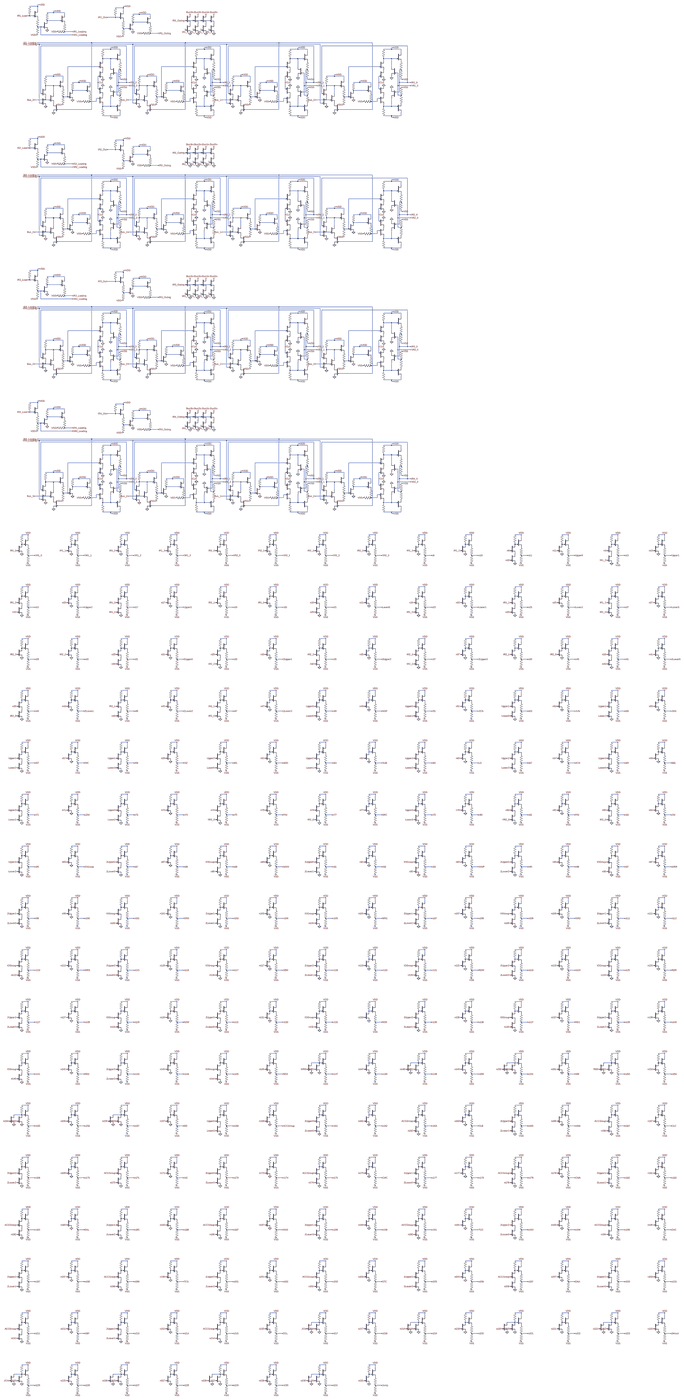
[diagram p0: schematic instruction_register_16bit.asc, whole sheet]
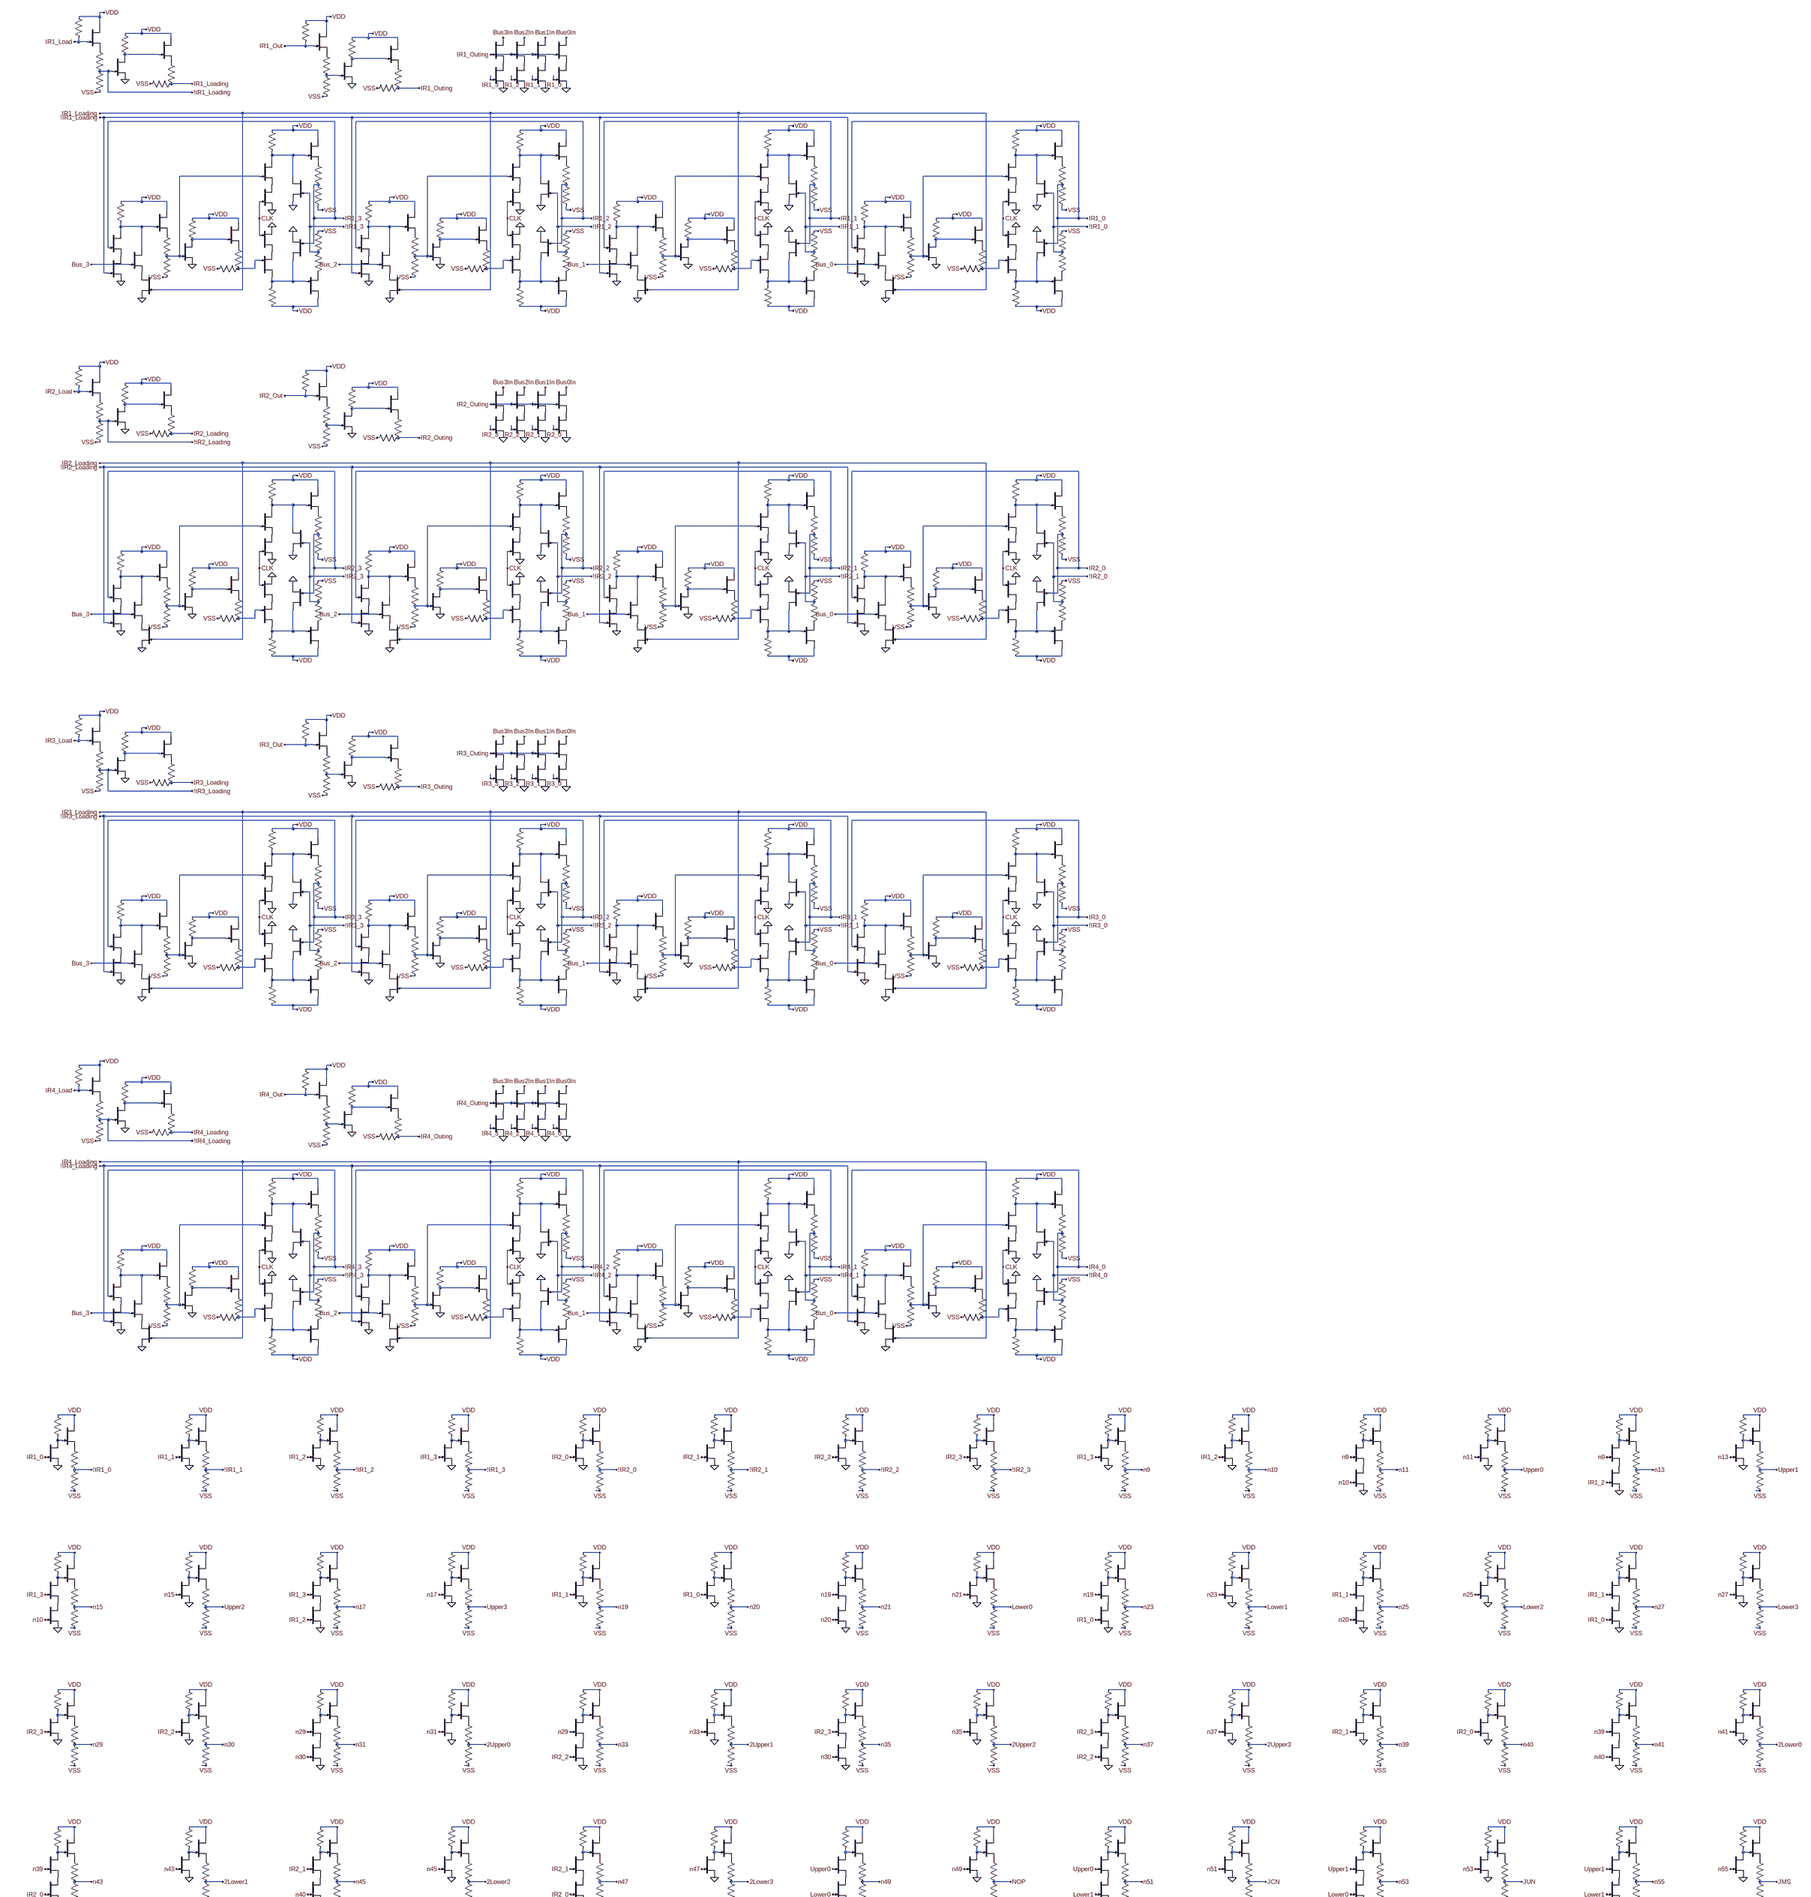
[diagram p1: schematic instruction_register_16bit.asc, part, row 1 of 2, column 1 of 1]
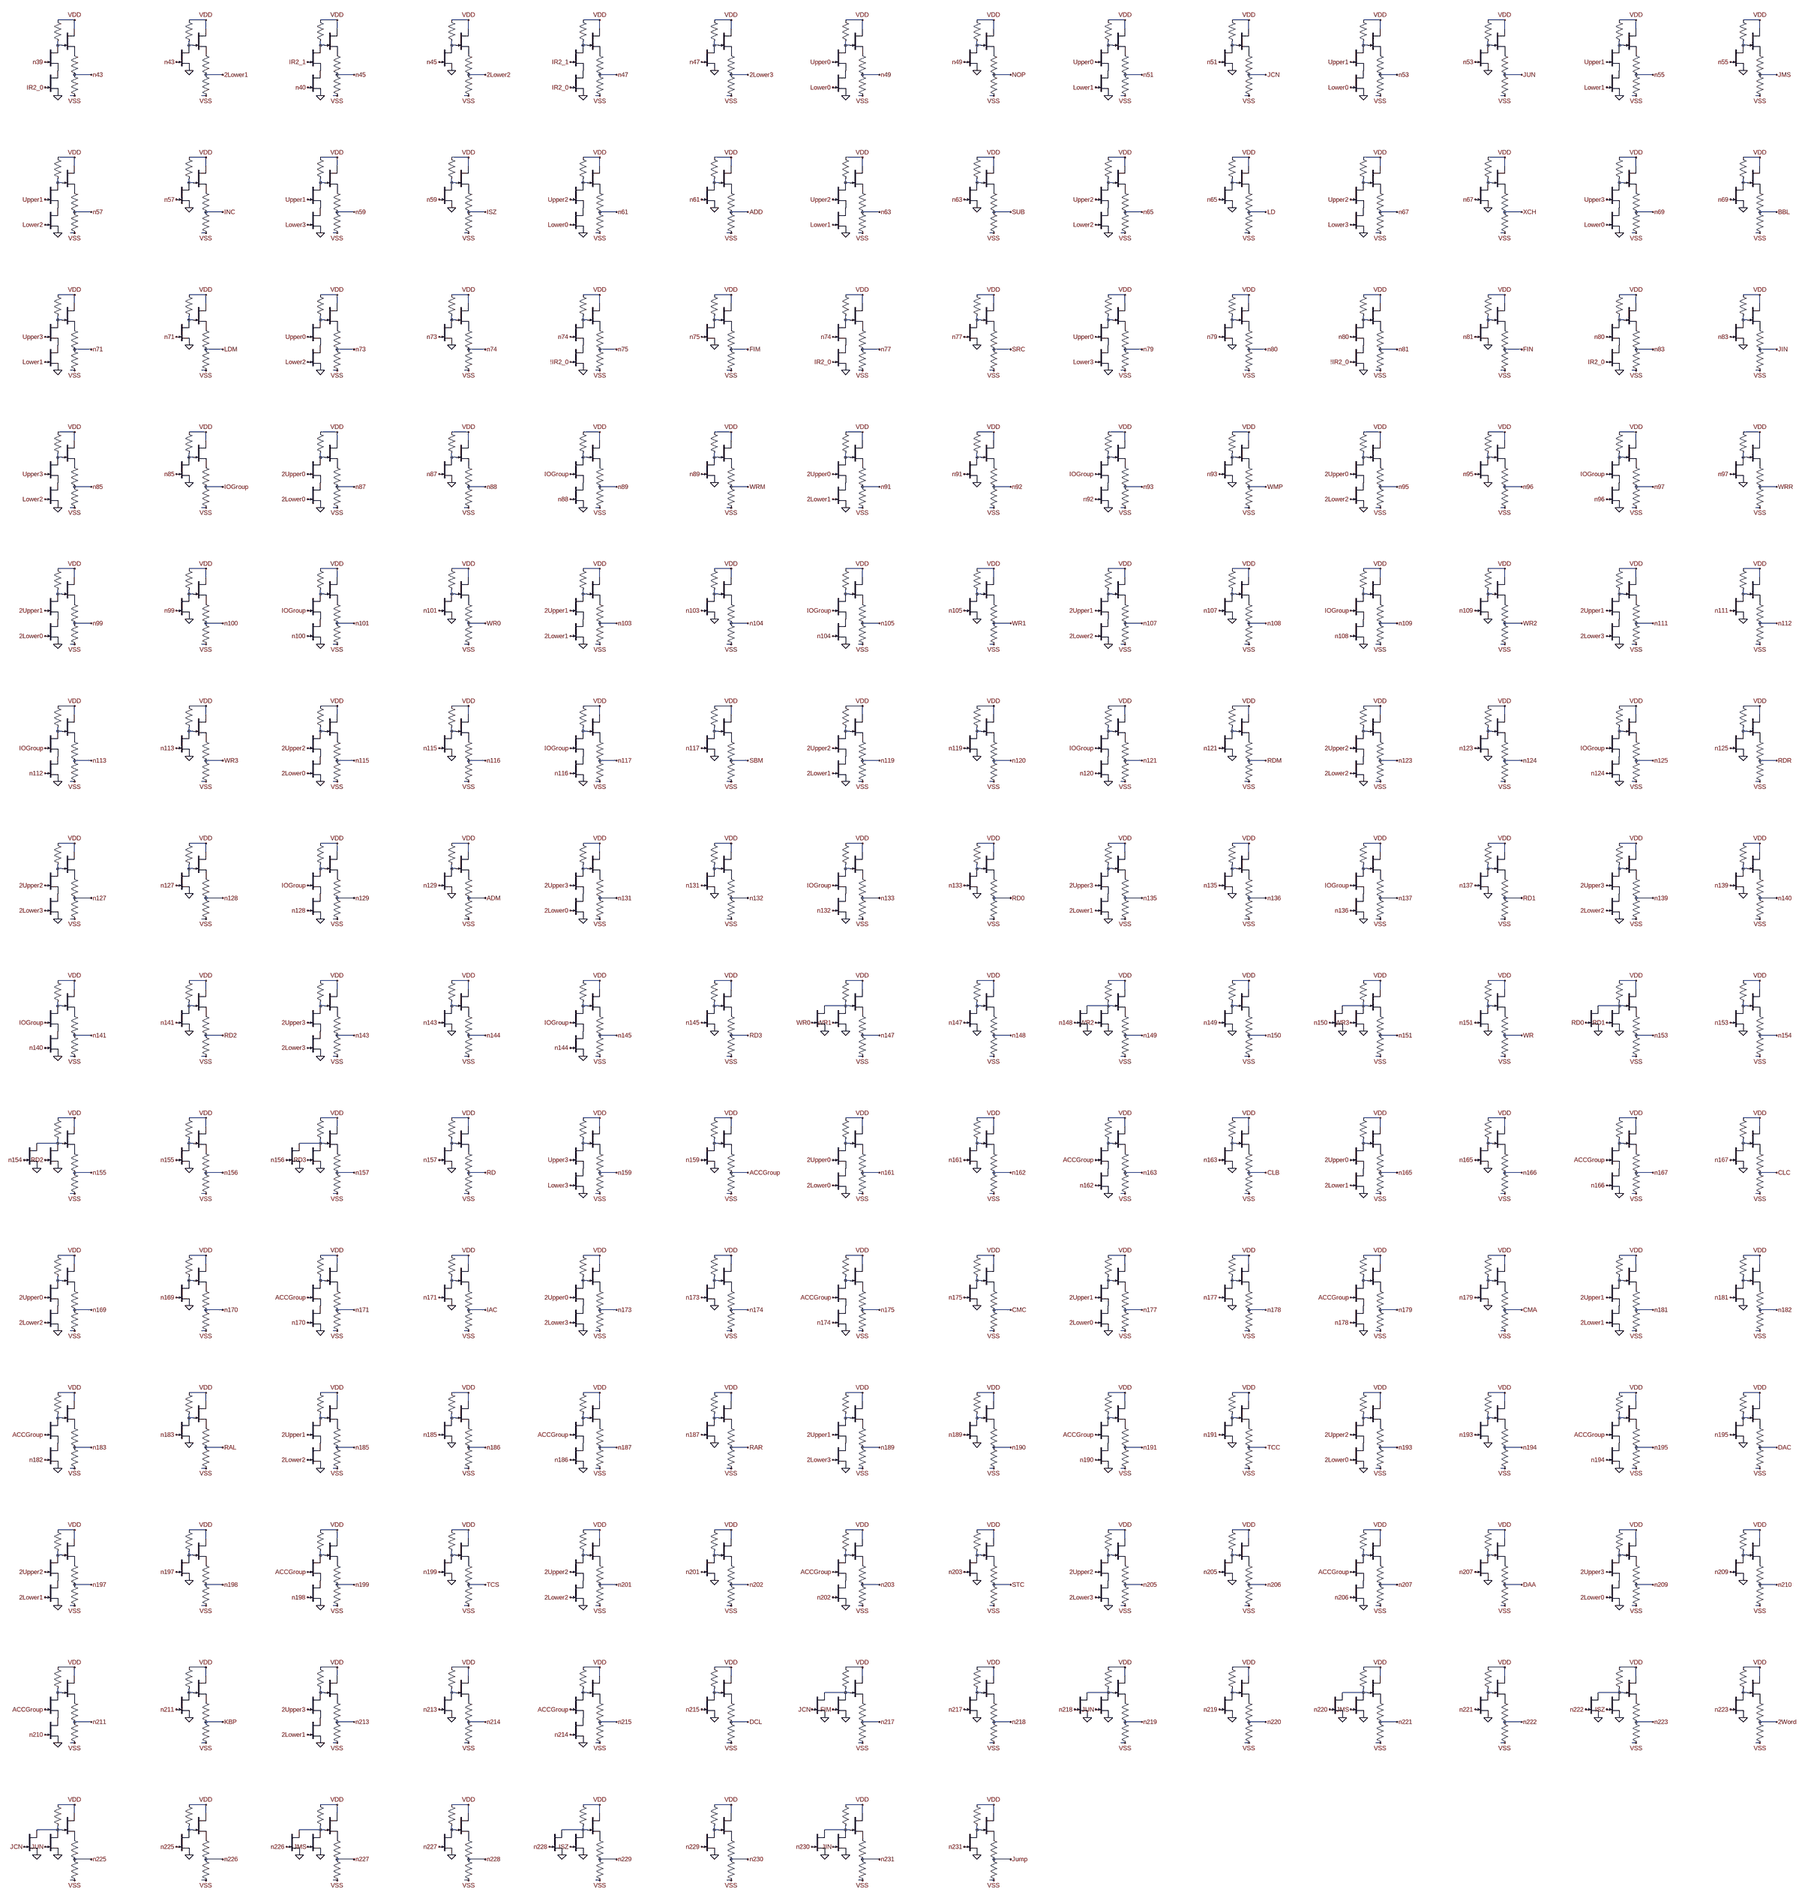
[diagram p2: schematic instruction_register_16bit.asc, part, row 2 of 2, column 1 of 1]
* instruction_register_16bit.asc
R1 VDD IR1_Load 100k
J_F1 VDD IR1_Load P001 DR
R2 P001 !IR1_Loading 1k
R3 !IR1_Loading VSS 4.8k
J_A1 N001 !IR1_Loading 0 DR
R4 VDD N001 50k
J_A2 VDD N001 P002 DR
R5 P002 IR1_Loading 1k
R6 IR1_Loading VSS 4.5k
R7 VDD IR1_Out 100k
J_F2 VDD IR1_Out P003 DR
R8 P003 N003 1k
R9 N003 VSS 4.8k
J_A3 N002 N003 0 DR
R10 VDD N002 50k
J_A4 VDD N002 P004 DR
R11 P004 IR1_Outing 1k
R12 IR1_Outing VSS 4.5k
J_A5 N004 N005 P005 DR
R13 VDD N004 100k
J_F3 VDD N004 P006 DR
R14 P006 IR1_3 1k
R15 IR1_3 VSS 4.8k
J_B1 N004 !IR1_3 0 DR
J_A6 N009 N008 P007 DR
R16 VDD N009 100k
J_F4 VDD N009 P008 DR
R17 P008 !IR1_3 1k
R18 !IR1_3 VSS 4.8k
J_B2 N009 IR1_3 0 DR
J_A7 P005 CLK 0 DR
J_A8 P007 CLK 0 DR
J_A9 N006 IR1_3 P009 DR
R19 VDD N006 100k
J_F5 VDD N006 P010 DR
R20 P010 N005 1k
R21 N005 VSS 4.8k
J_B3 N006 Bus_3 P011 DR
J_A10 N007 N005 0 DR
R22 VDD N007 50k
J_A11 VDD N007 P012 DR
R23 P012 N008 1k
R24 N008 VSS 4.5k
J_A12 P009 !IR1_Loading 0 DR
J_B4 P011 IR1_Loading 0 DR
J_A13 N010 N011 P013 DR
R25 VDD N010 100k
J_F6 VDD N010 P014 DR
R26 P014 IR1_2 1k
R27 IR1_2 VSS 4.8k
J_B5 N010 !IR1_2 0 DR
J_A14 N015 N014 P015 DR
R28 VDD N015 100k
J_F7 VDD N015 P016 DR
R29 P016 !IR1_2 1k
R30 !IR1_2 VSS 4.8k
J_B6 N015 IR1_2 0 DR
J_A15 P013 CLK 0 DR
J_A16 P015 CLK 0 DR
J_A17 N012 IR1_2 P017 DR
R31 VDD N012 100k
J_F8 VDD N012 P018 DR
R32 P018 N011 1k
R33 N011 VSS 4.8k
J_B7 N012 Bus_2 P019 DR
J_A18 N013 N011 0 DR
R34 VDD N013 50k
J_A19 VDD N013 P020 DR
R35 P020 N014 1k
R36 N014 VSS 4.5k
J_A20 P017 !IR1_Loading 0 DR
J_B8 P019 IR1_Loading 0 DR
J_A21 N016 N017 P021 DR
R37 VDD N016 100k
J_F9 VDD N016 P022 DR
R38 P022 IR1_1 1k
R39 IR1_1 VSS 4.8k
J_B9 N016 !IR1_1 0 DR
J_A22 N021 N020 P023 DR
R40 VDD N021 100k
J_F10 VDD N021 P024 DR
R41 P024 !IR1_1 1k
R42 !IR1_1 VSS 4.8k
J_B10 N021 IR1_1 0 DR
J_A23 P021 CLK 0 DR
J_A24 P023 CLK 0 DR
J_A25 N018 IR1_1 P025 DR
R43 VDD N018 100k
J_F11 VDD N018 P026 DR
R44 P026 N017 1k
R45 N017 VSS 4.8k
J_B11 N018 Bus_1 P027 DR
J_A26 N019 N017 0 DR
R46 VDD N019 50k
J_A27 VDD N019 P028 DR
R47 P028 N020 1k
R48 N020 VSS 4.5k
J_A28 P025 !IR1_Loading 0 DR
J_B12 P027 IR1_Loading 0 DR
J_A29 N022 N023 P029 DR
R49 VDD N022 100k
J_F12 VDD N022 P030 DR
R50 P030 IR1_0 1k
R51 IR1_0 VSS 4.8k
J_B13 N022 !IR1_0 0 DR
J_A30 N027 N026 P031 DR
R52 VDD N027 100k
J_F13 VDD N027 P032 DR
R53 P032 !IR1_0 1k
R54 !IR1_0 VSS 4.8k
J_B14 N027 IR1_0 0 DR
J_A31 P029 CLK 0 DR
J_A32 P031 CLK 0 DR
J_A33 N024 IR1_0 P033 DR
R55 VDD N024 100k
J_F14 VDD N024 P034 DR
R56 P034 N023 1k
R57 N023 VSS 4.8k
J_B15 N024 Bus_0 P035 DR
J_A34 N025 N023 0 DR
R58 VDD N025 50k
J_A35 VDD N025 P036 DR
R59 P036 N026 1k
R60 N026 VSS 4.5k
J_A36 P033 !IR1_Loading 0 DR
J_B16 P035 IR1_Loading 0 DR
J_BUS1 P037 IR1_3 0 DR
J_BUS2 Bus3In IR1_Outing P037 DR
J_BUS3 P038 IR1_2 0 DR
J_BUS4 Bus2In IR1_Outing P038 DR
J_BUS5 P039 IR1_1 0 DR
J_BUS6 Bus1In IR1_Outing P039 DR
J_BUS7 P040 IR1_0 0 DR
J_BUS8 Bus0In IR1_Outing P040 DR
R61 VDD IR2_Load 100k
J_F15 VDD IR2_Load P041 DR
R62 P041 !IR2_Loading 1k
R63 !IR2_Loading VSS 4.8k
J_A37 N028 !IR2_Loading 0 DR
R64 VDD N028 50k
J_A38 VDD N028 P042 DR
R65 P042 IR2_Loading 1k
R66 IR2_Loading VSS 4.5k
R67 VDD IR2_Out 100k
J_F16 VDD IR2_Out P043 DR
R68 P043 N030 1k
R69 N030 VSS 4.8k
J_A39 N029 N030 0 DR
R70 VDD N029 50k
J_A40 VDD N029 P044 DR
R71 P044 IR2_Outing 1k
R72 IR2_Outing VSS 4.5k
J_A41 N031 N032 P045 DR
R73 VDD N031 100k
J_F17 VDD N031 P046 DR
R74 P046 IR2_3 1k
R75 IR2_3 VSS 4.8k
J_B17 N031 !IR2_3 0 DR
J_A42 N036 N035 P047 DR
R76 VDD N036 100k
J_F18 VDD N036 P048 DR
R77 P048 !IR2_3 1k
R78 !IR2_3 VSS 4.8k
J_B18 N036 IR2_3 0 DR
J_A43 P045 CLK 0 DR
J_A44 P047 CLK 0 DR
J_A45 N033 IR2_3 P049 DR
R79 VDD N033 100k
J_F19 VDD N033 P050 DR
R80 P050 N032 1k
R81 N032 VSS 4.8k
J_B19 N033 Bus_3 P051 DR
J_A46 N034 N032 0 DR
R82 VDD N034 50k
J_A47 VDD N034 P052 DR
R83 P052 N035 1k
R84 N035 VSS 4.5k
J_A48 P049 !IR2_Loading 0 DR
J_B20 P051 IR2_Loading 0 DR
J_A49 N037 N038 P053 DR
R85 VDD N037 100k
J_F20 VDD N037 P054 DR
R86 P054 IR2_2 1k
R87 IR2_2 VSS 4.8k
J_B21 N037 !IR2_2 0 DR
J_A50 N042 N041 P055 DR
R88 VDD N042 100k
J_F21 VDD N042 P056 DR
R89 P056 !IR2_2 1k
R90 !IR2_2 VSS 4.8k
J_B22 N042 IR2_2 0 DR
J_A51 P053 CLK 0 DR
J_A52 P055 CLK 0 DR
J_A53 N039 IR2_2 P057 DR
R91 VDD N039 100k
J_F22 VDD N039 P058 DR
R92 P058 N038 1k
R93 N038 VSS 4.8k
J_B23 N039 Bus_2 P059 DR
J_A54 N040 N038 0 DR
R94 VDD N040 50k
J_A55 VDD N040 P060 DR
R95 P060 N041 1k
R96 N041 VSS 4.5k
J_A56 P057 !IR2_Loading 0 DR
J_B24 P059 IR2_Loading 0 DR
J_A57 N043 N044 P061 DR
R97 VDD N043 100k
J_F23 VDD N043 P062 DR
R98 P062 IR2_1 1k
R99 IR2_1 VSS 4.8k
J_B25 N043 !IR2_1 0 DR
J_A58 N048 N047 P063 DR
R100 VDD N048 100k
J_F24 VDD N048 P064 DR
R101 P064 !IR2_1 1k
R102 !IR2_1 VSS 4.8k
J_B26 N048 IR2_1 0 DR
J_A59 P061 CLK 0 DR
J_A60 P063 CLK 0 DR
J_A61 N045 IR2_1 P065 DR
R103 VDD N045 100k
J_F25 VDD N045 P066 DR
R104 P066 N044 1k
R105 N044 VSS 4.8k
J_B27 N045 Bus_1 P067 DR
J_A62 N046 N044 0 DR
R106 VDD N046 50k
J_A63 VDD N046 P068 DR
R107 P068 N047 1k
R108 N047 VSS 4.5k
J_A64 P065 !IR2_Loading 0 DR
J_B28 P067 IR2_Loading 0 DR
J_A65 N049 N050 P069 DR
R109 VDD N049 100k
J_F26 VDD N049 P070 DR
R110 P070 IR2_0 1k
R111 IR2_0 VSS 4.8k
J_B29 N049 !IR2_0 0 DR
J_A66 N054 N053 P071 DR
R112 VDD N054 100k
J_F27 VDD N054 P072 DR
R113 P072 !IR2_0 1k
R114 !IR2_0 VSS 4.8k
J_B30 N054 IR2_0 0 DR
J_A67 P069 CLK 0 DR
J_A68 P071 CLK 0 DR
J_A69 N051 IR2_0 P073 DR
R115 VDD N051 100k
J_F28 VDD N051 P074 DR
R116 P074 N050 1k
R117 N050 VSS 4.8k
J_B31 N051 Bus_0 P075 DR
J_A70 N052 N050 0 DR
R118 VDD N052 50k
J_A71 VDD N052 P076 DR
R119 P076 N053 1k
R120 N053 VSS 4.5k
J_A72 P073 !IR2_Loading 0 DR
J_B32 P075 IR2_Loading 0 DR
J_BUS9 P077 IR2_3 0 DR
J_BUS10 Bus3In IR2_Outing P077 DR
J_BUS11 P078 IR2_2 0 DR
J_BUS12 Bus2In IR2_Outing P078 DR
J_BUS13 P079 IR2_1 0 DR
J_BUS14 Bus1In IR2_Outing P079 DR
J_BUS15 P080 IR2_0 0 DR
J_BUS16 Bus0In IR2_Outing P080 DR
R121 VDD IR3_Load 100k
J_F29 VDD IR3_Load P081 DR
R122 P081 !IR3_Loading 1k
R123 !IR3_Loading VSS 4.8k
J_A73 N055 !IR3_Loading 0 DR
R124 VDD N055 50k
J_A74 VDD N055 P082 DR
R125 P082 IR3_Loading 1k
R126 IR3_Loading VSS 4.5k
R127 VDD IR3_Out 100k
J_F30 VDD IR3_Out P083 DR
R128 P083 N057 1k
R129 N057 VSS 4.8k
J_A75 N056 N057 0 DR
R130 VDD N056 50k
J_A76 VDD N056 P084 DR
R131 P084 IR3_Outing 1k
R132 IR3_Outing VSS 4.5k
J_A77 N058 N059 P085 DR
R133 VDD N058 100k
J_F31 VDD N058 P086 DR
R134 P086 IR3_3 1k
R135 IR3_3 VSS 4.8k
J_B33 N058 !IR3_3 0 DR
J_A78 N063 N062 P087 DR
R136 VDD N063 100k
J_F32 VDD N063 P088 DR
R137 P088 !IR3_3 1k
R138 !IR3_3 VSS 4.8k
J_B34 N063 IR3_3 0 DR
J_A79 P085 CLK 0 DR
J_A80 P087 CLK 0 DR
J_A81 N060 IR3_3 P089 DR
R139 VDD N060 100k
J_F33 VDD N060 P090 DR
R140 P090 N059 1k
R141 N059 VSS 4.8k
J_B35 N060 Bus_3 P091 DR
J_A82 N061 N059 0 DR
R142 VDD N061 50k
J_A83 VDD N061 P092 DR
R143 P092 N062 1k
R144 N062 VSS 4.5k
J_A84 P089 !IR3_Loading 0 DR
J_B36 P091 IR3_Loading 0 DR
J_A85 N064 N065 P093 DR
R145 VDD N064 100k
J_F34 VDD N064 P094 DR
R146 P094 IR3_2 1k
R147 IR3_2 VSS 4.8k
J_B37 N064 !IR3_2 0 DR
J_A86 N069 N068 P095 DR
R148 VDD N069 100k
J_F35 VDD N069 P096 DR
R149 P096 !IR3_2 1k
R150 !IR3_2 VSS 4.8k
J_B38 N069 IR3_2 0 DR
J_A87 P093 CLK 0 DR
J_A88 P095 CLK 0 DR
J_A89 N066 IR3_2 P097 DR
R151 VDD N066 100k
J_F36 VDD N066 P098 DR
R152 P098 N065 1k
R153 N065 VSS 4.8k
J_B39 N066 Bus_2 P099 DR
J_A90 N067 N065 0 DR
R154 VDD N067 50k
J_A91 VDD N067 P100 DR
R155 P100 N068 1k
R156 N068 VSS 4.5k
J_A92 P097 !IR3_Loading 0 DR
J_B40 P099 IR3_Loading 0 DR
J_A93 N070 N071 P101 DR
R157 VDD N070 100k
J_F37 VDD N070 P102 DR
R158 P102 IR3_1 1k
R159 IR3_1 VSS 4.8k
J_B41 N070 !IR3_1 0 DR
J_A94 N075 N074 P103 DR
R160 VDD N075 100k
J_F38 VDD N075 P104 DR
R161 P104 !IR3_1 1k
R162 !IR3_1 VSS 4.8k
J_B42 N075 IR3_1 0 DR
J_A95 P101 CLK 0 DR
J_A96 P103 CLK 0 DR
J_A97 N072 IR3_1 P105 DR
R163 VDD N072 100k
J_F39 VDD N072 P106 DR
R164 P106 N071 1k
R165 N071 VSS 4.8k
J_B43 N072 Bus_1 P107 DR
J_A98 N073 N071 0 DR
R166 VDD N073 50k
J_A99 VDD N073 P108 DR
R167 P108 N074 1k
R168 N074 VSS 4.5k
J_A100 P105 !IR3_Loading 0 DR
J_B44 P107 IR3_Loading 0 DR
J_A101 N076 N077 P109 DR
R169 VDD N076 100k
J_F40 VDD N076 P110 DR
R170 P110 IR3_0 1k
R171 IR3_0 VSS 4.8k
J_B45 N076 !IR3_0 0 DR
J_A102 N081 N080 P111 DR
R172 VDD N081 100k
J_F41 VDD N081 P112 DR
R173 P112 !IR3_0 1k
R174 !IR3_0 VSS 4.8k
J_B46 N081 IR3_0 0 DR
J_A103 P109 CLK 0 DR
J_A104 P111 CLK 0 DR
J_A105 N078 IR3_0 P113 DR
R175 VDD N078 100k
J_F42 VDD N078 P114 DR
R176 P114 N077 1k
R177 N077 VSS 4.8k
J_B47 N078 Bus_0 P115 DR
J_A106 N079 N077 0 DR
R178 VDD N079 50k
J_A107 VDD N079 P116 DR
R179 P116 N080 1k
R180 N080 VSS 4.5k
J_A108 P113 !IR3_Loading 0 DR
J_B48 P115 IR3_Loading 0 DR
J_BUS17 P117 IR3_3 0 DR
J_BUS18 Bus3In IR3_Outing P117 DR
J_BUS19 P118 IR3_2 0 DR
J_BUS20 Bus2In IR3_Outing P118 DR
J_BUS21 P119 IR3_1 0 DR
J_BUS22 Bus1In IR3_Outing P119 DR
J_BUS23 P120 IR3_0 0 DR
J_BUS24 Bus0In IR3_Outing P120 DR
R181 VDD IR4_Load 100k
J_F43 VDD IR4_Load P121 DR
R182 P121 !IR4_Loading 1k
R183 !IR4_Loading VSS 4.8k
J_A109 N082 !IR4_Loading 0 DR
R184 VDD N082 50k
J_A110 VDD N082 P122 DR
R185 P122 IR4_Loading 1k
R186 IR4_Loading VSS 4.5k
R187 VDD IR4_Out 100k
J_F44 VDD IR4_Out P123 DR
R188 P123 N084 1k
R189 N084 VSS 4.8k
J_A111 N083 N084 0 DR
R190 VDD N083 50k
J_A112 VDD N083 P124 DR
R191 P124 IR4_Outing 1k
R192 IR4_Outing VSS 4.5k
J_A113 N085 N086 P125 DR
R193 VDD N085 100k
J_F45 VDD N085 P126 DR
R194 P126 IR4_3 1k
R195 IR4_3 VSS 4.8k
J_B49 N085 !IR4_3 0 DR
J_A114 N090 N089 P127 DR
R196 VDD N090 100k
J_F46 VDD N090 P128 DR
R197 P128 !IR4_3 1k
R198 !IR4_3 VSS 4.8k
J_B50 N090 IR4_3 0 DR
J_A115 P125 CLK 0 DR
J_A116 P127 CLK 0 DR
J_A117 N087 IR4_3 P129 DR
R199 VDD N087 100k
J_F47 VDD N087 P130 DR
R200 P130 N086 1k
R201 N086 VSS 4.8k
J_B51 N087 Bus_3 P131 DR
J_A118 N088 N086 0 DR
R202 VDD N088 50k
J_A119 VDD N088 P132 DR
R203 P132 N089 1k
R204 N089 VSS 4.5k
J_A120 P129 !IR4_Loading 0 DR
J_B52 P131 IR4_Loading 0 DR
J_A121 N091 N092 P133 DR
R205 VDD N091 100k
J_F48 VDD N091 P134 DR
R206 P134 IR4_2 1k
R207 IR4_2 VSS 4.8k
J_B53 N091 !IR4_2 0 DR
J_A122 N096 N095 P135 DR
R208 VDD N096 100k
J_F49 VDD N096 P136 DR
R209 P136 !IR4_2 1k
R210 !IR4_2 VSS 4.8k
J_B54 N096 IR4_2 0 DR
J_A123 P133 CLK 0 DR
J_A124 P135 CLK 0 DR
J_A125 N093 IR4_2 P137 DR
R211 VDD N093 100k
J_F50 VDD N093 P138 DR
R212 P138 N092 1k
R213 N092 VSS 4.8k
J_B55 N093 Bus_2 P139 DR
J_A126 N094 N092 0 DR
R214 VDD N094 50k
J_A127 VDD N094 P140 DR
R215 P140 N095 1k
R216 N095 VSS 4.5k
J_A128 P137 !IR4_Loading 0 DR
J_B56 P139 IR4_Loading 0 DR
J_A129 N097 N098 P141 DR
R217 VDD N097 100k
J_F51 VDD N097 P142 DR
R218 P142 IR4_1 1k
R219 IR4_1 VSS 4.8k
J_B57 N097 !IR4_1 0 DR
J_A130 N110 N106 P143 DR
R220 VDD N110 100k
J_F52 VDD N110 P144 DR
R221 P144 !IR4_1 1k
R222 !IR4_1 VSS 4.8k
J_B58 N110 IR4_1 0 DR
J_A131 P141 CLK 0 DR
J_A132 P143 CLK 0 DR
J_A133 N099 IR4_1 P145 DR
R223 VDD N099 100k
J_F53 VDD N099 P146 DR
R224 P146 N098 1k
R225 N098 VSS 4.8k
J_B59 N099 Bus_1 P147 DR
J_A134 N102 N098 0 DR
R226 VDD N102 50k
J_A135 VDD N102 P148 DR
R227 P148 N106 1k
R228 N106 VSS 4.5k
J_A136 P145 !IR4_Loading 0 DR
J_B60 P147 IR4_Loading 0 DR
J_A137 N114 N118 P149 DR
R229 VDD N114 100k
J_F54 VDD N114 P150 DR
R230 P150 IR4_0 1k
R231 IR4_0 VSS 4.8k
J_B61 N114 !IR4_0 0 DR
J_A138 N134 N130 P151 DR
R232 VDD N134 100k
J_F55 VDD N134 P152 DR
R233 P152 !IR4_0 1k
R234 !IR4_0 VSS 4.8k
J_B62 N134 IR4_0 0 DR
J_A139 P149 CLK 0 DR
J_A140 P151 CLK 0 DR
J_A141 N122 IR4_0 P153 DR
R235 VDD N122 100k
J_F56 VDD N122 P154 DR
R236 P154 N118 1k
R237 N118 VSS 4.8k
J_B63 N122 Bus_0 P155 DR
J_A142 N126 N118 0 DR
R238 VDD N126 50k
J_A143 VDD N126 P156 DR
R239 P156 N130 1k
R240 N130 VSS 4.5k
J_A144 P153 !IR4_Loading 0 DR
J_B64 P155 IR4_Loading 0 DR
J_BUS25 P157 IR4_3 0 DR
J_BUS26 Bus3In IR4_Outing P157 DR
J_BUS27 P158 IR4_2 0 DR
J_BUS28 Bus2In IR4_Outing P158 DR
J_BUS29 P159 IR4_1 0 DR
J_BUS30 Bus1In IR4_Outing P159 DR
J_BUS31 P160 IR4_0 0 DR
J_BUS32 Bus0In IR4_Outing P160 DR
R241 VDD N138 100k
J_F57 VDD N138 P161 DR
R242 P161 !IR1_0 1k
R243 !IR1_0 VSS 4.8k
J_B65 N138 IR1_0 0 DR
R244 VDD N142 100k
J_F58 VDD N142 P162 DR
R245 P162 !IR1_1 1k
R246 !IR1_1 VSS 4.8k
J_B66 N142 IR1_1 0 DR
R247 VDD N146 100k
J_F59 VDD N146 P163 DR
R248 P163 !IR1_2 1k
R249 !IR1_2 VSS 4.8k
J_B67 N146 IR1_2 0 DR
R250 VDD N152 100k
J_F60 VDD N152 P164 DR
R251 P164 !IR1_3 1k
R252 !IR1_3 VSS 4.8k
J_B68 N152 IR1_3 0 DR
R253 VDD N158 100k
J_F61 VDD N158 P165 DR
R254 P165 !IR2_0 1k
R255 !IR2_0 VSS 4.8k
J_B69 N158 IR2_0 0 DR
R256 VDD N160 100k
J_F62 VDD N160 P166 DR
R257 P166 !IR2_1 1k
R258 !IR2_1 VSS 4.8k
J_B70 N160 IR2_1 0 DR
R259 VDD N164 100k
J_F63 VDD N164 P167 DR
R260 P167 !IR2_2 1k
R261 !IR2_2 VSS 4.8k
J_B71 N164 IR2_2 0 DR
R262 VDD N168 100k
J_F64 VDD N168 P168 DR
R263 P168 !IR2_3 1k
R264 !IR2_3 VSS 4.8k
J_B72 N168 IR2_3 0 DR
R265 VDD N172 100k
J_F65 VDD N172 P169 DR
R266 P169 n9 1k
R267 n9 VSS 4.8k
J_B73 N172 IR1_3 0 DR
R268 VDD N176 100k
J_F66 VDD N176 P170 DR
R269 P170 n10 1k
R270 n10 VSS 4.8k
J_B74 N176 IR1_2 0 DR
R271 VDD N180 100k
J_F67 VDD N180 P171 DR
R272 P171 n11 1k
R273 n11 VSS 4.8k
J_B75 N180 n9 P172 DR
J_A145 P172 n10 0 DR
R274 VDD N184 100k
J_F68 VDD N184 P173 DR
R275 P173 Upper0 1k
R276 Upper0 VSS 4.8k
J_B76 N184 n11 0 DR
R277 VDD N188 100k
J_F69 VDD N188 P174 DR
R278 P174 n13 1k
R279 n13 VSS 4.8k
J_B77 N188 n9 P175 DR
J_A146 P175 IR1_2 0 DR
R280 VDD N192 100k
J_F70 VDD N192 P176 DR
R281 P176 Upper1 1k
R282 Upper1 VSS 4.8k
J_B78 N192 n13 0 DR
R283 VDD N196 100k
J_F71 VDD N196 P177 DR
R284 P177 n15 1k
R285 n15 VSS 4.8k
J_B79 N196 IR1_3 P178 DR
J_A147 P178 n10 0 DR
R286 VDD N200 100k
J_F72 VDD N200 P179 DR
R287 P179 Upper2 1k
R288 Upper2 VSS 4.8k
J_B80 N200 n15 0 DR
R289 VDD N204 100k
J_F73 VDD N204 P180 DR
R290 P180 n17 1k
R291 n17 VSS 4.8k
J_B81 N204 IR1_3 P181 DR
J_A148 P181 IR1_2 0 DR
R292 VDD N208 100k
J_F74 VDD N208 P182 DR
R293 P182 Upper3 1k
R294 Upper3 VSS 4.8k
J_B82 N208 n17 0 DR
R295 VDD N212 100k
J_F75 VDD N212 P183 DR
R296 P183 n19 1k
R297 n19 VSS 4.8k
J_B83 N212 IR1_1 0 DR
R298 VDD N216 100k
J_F76 VDD N216 P184 DR
R299 P184 n20 1k
R300 n20 VSS 4.8k
J_B84 N216 IR1_0 0 DR
R301 VDD N224 100k
J_F77 VDD N224 P185 DR
R302 P185 n21 1k
R303 n21 VSS 4.8k
J_B85 N224 n19 P186 DR
J_A149 P186 n20 0 DR
R304 VDD N232 100k
J_F78 VDD N232 P187 DR
R305 P187 Lower0 1k
R306 Lower0 VSS 4.8k
J_B86 N232 n21 0 DR
R307 VDD N233 100k
J_F79 VDD N233 P188 DR
R308 P188 n23 1k
R309 n23 VSS 4.8k
J_B87 N233 n19 P189 DR
J_A150 P189 IR1_0 0 DR
R310 VDD N234 100k
J_F80 VDD N234 P190 DR
R311 P190 Lower1 1k
R312 Lower1 VSS 4.8k
J_B88 N234 n23 0 DR
R313 VDD N235 100k
J_F81 VDD N235 P191 DR
R314 P191 n25 1k
R315 n25 VSS 4.8k
J_B89 N235 IR1_1 P192 DR
J_A151 P192 n20 0 DR
R316 VDD N236 100k
J_F82 VDD N236 P193 DR
R317 P193 Lower2 1k
R318 Lower2 VSS 4.8k
J_B90 N236 n25 0 DR
R319 VDD N237 100k
J_F83 VDD N237 P194 DR
R320 P194 n27 1k
R321 n27 VSS 4.8k
J_B91 N237 IR1_1 P195 DR
J_A152 P195 IR1_0 0 DR
R322 VDD N238 100k
J_F84 VDD N238 P196 DR
R323 P196 Lower3 1k
R324 Lower3 VSS 4.8k
J_B92 N238 n27 0 DR
R325 VDD N239 100k
J_F85 VDD N239 P197 DR
R326 P197 n29 1k
R327 n29 VSS 4.8k
J_B93 N239 IR2_3 0 DR
R328 VDD N240 100k
J_F86 VDD N240 P198 DR
R329 P198 n30 1k
R330 n30 VSS 4.8k
J_B94 N240 IR2_2 0 DR
R331 VDD N241 100k
J_F87 VDD N241 P199 DR
R332 P199 n31 1k
R333 n31 VSS 4.8k
J_B95 N241 n29 P200 DR
J_A153 P200 n30 0 DR
R334 VDD N242 100k
J_F88 VDD N242 P201 DR
R335 P201 2Upper0 1k
R336 2Upper0 VSS 4.8k
J_B96 N242 n31 0 DR
R337 VDD N243 100k
J_F89 VDD N243 P202 DR
R338 P202 n33 1k
R339 n33 VSS 4.8k
J_B97 N243 n29 P203 DR
J_A154 P203 IR2_2 0 DR
R340 VDD N244 100k
J_F90 VDD N244 P204 DR
R341 P204 2Upper1 1k
R342 2Upper1 VSS 4.8k
J_B98 N244 n33 0 DR
R343 VDD N245 100k
J_F91 VDD N245 P205 DR
R344 P205 n35 1k
R345 n35 VSS 4.8k
J_B99 N245 IR2_3 P206 DR
J_A155 P206 n30 0 DR
R346 VDD N246 100k
J_F92 VDD N246 P207 DR
R347 P207 2Upper2 1k
R348 2Upper2 VSS 4.8k
J_B100 N246 n35 0 DR
R349 VDD N247 100k
J_F93 VDD N247 P208 DR
R350 P208 n37 1k
R351 n37 VSS 4.8k
J_B101 N247 IR2_3 P209 DR
J_A156 P209 IR2_2 0 DR
R352 VDD N248 100k
J_F94 VDD N248 P210 DR
R353 P210 2Upper3 1k
R354 2Upper3 VSS 4.8k
J_B102 N248 n37 0 DR
R355 VDD N249 100k
J_F95 VDD N249 P211 DR
R356 P211 n39 1k
R357 n39 VSS 4.8k
J_B103 N249 IR2_1 0 DR
R358 VDD N250 100k
J_F96 VDD N250 P212 DR
R359 P212 n40 1k
R360 n40 VSS 4.8k
J_B104 N250 IR2_0 0 DR
R361 VDD N251 100k
J_F97 VDD N251 P213 DR
R362 P213 n41 1k
R363 n41 VSS 4.8k
J_B105 N251 n39 P214 DR
J_A157 P214 n40 0 DR
R364 VDD N252 100k
J_F98 VDD N252 P215 DR
R365 P215 2Lower0 1k
R366 2Lower0 VSS 4.8k
J_B106 N252 n41 0 DR
R367 VDD N253 100k
J_F99 VDD N253 P216 DR
R368 P216 n43 1k
R369 n43 VSS 4.8k
J_B107 N253 n39 P217 DR
J_A158 P217 IR2_0 0 DR
R370 VDD N254 100k
J_F100 VDD N254 P218 DR
R371 P218 2Lower1 1k
R372 2Lower1 VSS 4.8k
J_B108 N254 n43 0 DR
R373 VDD N255 100k
J_F101 VDD N255 P219 DR
R374 P219 n45 1k
R375 n45 VSS 4.8k
J_B109 N255 IR2_1 P220 DR
J_A159 P220 n40 0 DR
R376 VDD N256 100k
J_F102 VDD N256 P221 DR
R377 P221 2Lower2 1k
R378 2Lower2 VSS 4.8k
J_B110 N256 n45 0 DR
R379 VDD N257 100k
J_F103 VDD N257 P222 DR
R380 P222 n47 1k
R381 n47 VSS 4.8k
J_B111 N257 IR2_1 P223 DR
J_A160 P223 IR2_0 0 DR
R382 VDD N258 100k
J_F104 VDD N258 P224 DR
R383 P224 2Lower3 1k
R384 2Lower3 VSS 4.8k
J_B112 N258 n47 0 DR
R385 VDD N259 100k
J_F105 VDD N259 P225 DR
R386 P225 n49 1k
R387 n49 VSS 4.8k
J_B113 N259 Upper0 P226 DR
J_A161 P226 Lower0 0 DR
R388 VDD N260 100k
J_F106 VDD N260 P227 DR
R389 P227 NOP 1k
R390 NOP VSS 4.8k
J_B114 N260 n49 0 DR
R391 VDD N261 100k
J_F107 VDD N261 P228 DR
R392 P228 n51 1k
R393 n51 VSS 4.8k
J_B115 N261 Upper0 P229 DR
J_A162 P229 Lower1 0 DR
R394 VDD N262 100k
J_F108 VDD N262 P230 DR
R395 P230 JCN 1k
R396 JCN VSS 4.8k
J_B116 N262 n51 0 DR
R397 VDD N263 100k
J_F109 VDD N263 P231 DR
R398 P231 n53 1k
R399 n53 VSS 4.8k
J_B117 N263 Upper1 P232 DR
J_A163 P232 Lower0 0 DR
R400 VDD N264 100k
J_F110 VDD N264 P233 DR
R401 P233 JUN 1k
R402 JUN VSS 4.8k
J_B118 N264 n53 0 DR
R403 VDD N265 100k
J_F111 VDD N265 P234 DR
R404 P234 n55 1k
R405 n55 VSS 4.8k
J_B119 N265 Upper1 P235 DR
J_A164 P235 Lower1 0 DR
R406 VDD N266 100k
J_F112 VDD N266 P236 DR
R407 P236 JMS 1k
R408 JMS VSS 4.8k
J_B120 N266 n55 0 DR
R409 VDD N267 100k
J_F113 VDD N267 P237 DR
R410 P237 n57 1k
R411 n57 VSS 4.8k
J_B121 N267 Upper1 P238 DR
J_A165 P238 Lower2 0 DR
R412 VDD N268 100k
J_F114 VDD N268 P239 DR
R413 P239 INC 1k
R414 INC VSS 4.8k
J_B122 N268 n57 0 DR
R415 VDD N269 100k
J_F115 VDD N269 P240 DR
R416 P240 n59 1k
R417 n59 VSS 4.8k
J_B123 N269 Upper1 P241 DR
J_A166 P241 Lower3 0 DR
R418 VDD N270 100k
J_F116 VDD N270 P242 DR
R419 P242 ISZ 1k
R420 ISZ VSS 4.8k
J_B124 N270 n59 0 DR
R421 VDD N271 100k
J_F117 VDD N271 P243 DR
R422 P243 n61 1k
R423 n61 VSS 4.8k
J_B125 N271 Upper2 P244 DR
J_A167 P244 Lower0 0 DR
R424 VDD N272 100k
J_F118 VDD N272 P245 DR
R425 P245 ADD 1k
R426 ADD VSS 4.8k
J_B126 N272 n61 0 DR
R427 VDD N273 100k
J_F119 VDD N273 P246 DR
R428 P246 n63 1k
R429 n63 VSS 4.8k
J_B127 N273 Upper2 P247 DR
J_A168 P247 Lower1 0 DR
R430 VDD N274 100k
J_F120 VDD N274 P248 DR
R431 P248 SUB 1k
R432 SUB VSS 4.8k
J_B128 N274 n63 0 DR
R433 VDD N275 100k
J_F121 VDD N275 P249 DR
R434 P249 n65 1k
R435 n65 VSS 4.8k
J_B129 N275 Upper2 P250 DR
J_A169 P250 Lower2 0 DR
R436 VDD N276 100k
J_F122 VDD N276 P251 DR
R437 P251 LD 1k
R438 LD VSS 4.8k
J_B130 N276 n65 0 DR
R439 VDD N277 100k
J_F123 VDD N277 P252 DR
R440 P252 n67 1k
R441 n67 VSS 4.8k
J_B131 N277 Upper2 P253 DR
J_A170 P253 Lower3 0 DR
R442 VDD N278 100k
J_F124 VDD N278 P254 DR
R443 P254 XCH 1k
R444 XCH VSS 4.8k
J_B132 N278 n67 0 DR
R445 VDD N279 100k
J_F125 VDD N279 P255 DR
R446 P255 n69 1k
R447 n69 VSS 4.8k
J_B133 N279 Upper3 P256 DR
J_A171 P256 Lower0 0 DR
R448 VDD N280 100k
J_F126 VDD N280 P257 DR
R449 P257 BBL 1k
R450 BBL VSS 4.8k
J_B134 N280 n69 0 DR
R451 VDD N281 100k
J_F127 VDD N281 P258 DR
R452 P258 n71 1k
R453 n71 VSS 4.8k
J_B135 N281 Upper3 P259 DR
J_A172 P259 Lower1 0 DR
R454 VDD N282 100k
J_F128 VDD N282 P260 DR
R455 P260 LDM 1k
R456 LDM VSS 4.8k
J_B136 N282 n71 0 DR
R457 VDD N283 100k
J_F129 VDD N283 P261 DR
R458 P261 n73 1k
R459 n73 VSS 4.8k
J_B137 N283 Upper0 P262 DR
J_A173 P262 Lower2 0 DR
R460 VDD N284 100k
J_F130 VDD N284 P263 DR
R461 P263 n74 1k
R462 n74 VSS 4.8k
J_B138 N284 n73 0 DR
R463 VDD N285 100k
J_F131 VDD N285 P264 DR
R464 P264 n75 1k
R465 n75 VSS 4.8k
J_B139 N285 n74 P265 DR
J_A174 P265 !IR2_0 0 DR
R466 VDD N286 100k
J_F132 VDD N286 P266 DR
R467 P266 FIM 1k
R468 FIM VSS 4.8k
J_B140 N286 n75 0 DR
R469 VDD N287 100k
J_F133 VDD N287 P267 DR
R470 P267 n77 1k
R471 n77 VSS 4.8k
J_B141 N287 n74 P268 DR
J_A175 P268 IR2_0 0 DR
R472 VDD N288 100k
J_F134 VDD N288 P269 DR
R473 P269 SRC 1k
R474 SRC VSS 4.8k
J_B142 N288 n77 0 DR
R475 VDD N289 100k
J_F135 VDD N289 P270 DR
R476 P270 n79 1k
R477 n79 VSS 4.8k
J_B143 N289 Upper0 P271 DR
J_A176 P271 Lower3 0 DR
R478 VDD N290 100k
J_F136 VDD N290 P272 DR
R479 P272 n80 1k
R480 n80 VSS 4.8k
J_B144 N290 n79 0 DR
R481 VDD N291 100k
J_F137 VDD N291 P273 DR
R482 P273 n81 1k
R483 n81 VSS 4.8k
J_B145 N291 n80 P274 DR
J_A177 P274 !IR2_0 0 DR
R484 VDD N292 100k
J_F138 VDD N292 P275 DR
R485 P275 FIN 1k
R486 FIN VSS 4.8k
J_B146 N292 n81 0 DR
R487 VDD N293 100k
J_F139 VDD N293 P276 DR
R488 P276 n83 1k
R489 n83 VSS 4.8k
J_B147 N293 n80 P277 DR
J_A178 P277 IR2_0 0 DR
R490 VDD N294 100k
J_F140 VDD N294 P278 DR
R491 P278 JIN 1k
R492 JIN VSS 4.8k
J_B148 N294 n83 0 DR
R493 VDD N295 100k
J_F141 VDD N295 P279 DR
R494 P279 n85 1k
R495 n85 VSS 4.8k
J_B149 N295 Upper3 P280 DR
J_A179 P280 Lower2 0 DR
R496 VDD N296 100k
J_F142 VDD N296 P281 DR
R497 P281 IOGroup 1k
R498 IOGroup VSS 4.8k
J_B150 N296 n85 0 DR
R499 VDD N297 100k
J_F143 VDD N297 P282 DR
R500 P282 n87 1k
R501 n87 VSS 4.8k
J_B151 N297 2Upper0 P283 DR
J_A180 P283 2Lower0 0 DR
R502 VDD N298 100k
J_F144 VDD N298 P284 DR
R503 P284 n88 1k
R504 n88 VSS 4.8k
J_B152 N298 n87 0 DR
R505 VDD N299 100k
J_F145 VDD N299 P285 DR
R506 P285 n89 1k
R507 n89 VSS 4.8k
J_B153 N299 IOGroup P286 DR
J_A181 P286 n88 0 DR
R508 VDD N300 100k
J_F146 VDD N300 P287 DR
R509 P287 WRM 1k
R510 WRM VSS 4.8k
J_B154 N300 n89 0 DR
R511 VDD N301 100k
J_F147 VDD N301 P288 DR
R512 P288 n91 1k
R513 n91 VSS 4.8k
J_B155 N301 2Upper0 P289 DR
J_A182 P289 2Lower1 0 DR
R514 VDD N302 100k
J_F148 VDD N302 P290 DR
R515 P290 n92 1k
R516 n92 VSS 4.8k
J_B156 N302 n91 0 DR
R517 VDD N303 100k
J_F149 VDD N303 P291 DR
R518 P291 n93 1k
R519 n93 VSS 4.8k
J_B157 N303 IOGroup P292 DR
J_A183 P292 n92 0 DR
R520 VDD N304 100k
J_F150 VDD N304 P293 DR
R521 P293 WMP 1k
R522 WMP VSS 4.8k
J_B158 N304 n93 0 DR
R523 VDD N305 100k
J_F151 VDD N305 P294 DR
R524 P294 n95 1k
R525 n95 VSS 4.8k
J_B159 N305 2Upper0 P295 DR
J_A184 P295 2Lower2 0 DR
R526 VDD N306 100k
J_F152 VDD N306 P296 DR
R527 P296 n96 1k
R528 n96 VSS 4.8k
J_B160 N306 n95 0 DR
R529 VDD N307 100k
J_F153 VDD N307 P297 DR
R530 P297 n97 1k
R531 n97 VSS 4.8k
J_B161 N307 IOGroup P298 DR
J_A185 P298 n96 0 DR
R532 VDD N308 100k
J_F154 VDD N308 P299 DR
R533 P299 WRR 1k
R534 WRR VSS 4.8k
J_B162 N308 n97 0 DR
R535 VDD N309 100k
J_F155 VDD N309 P300 DR
R536 P300 n99 1k
R537 n99 VSS 4.8k
J_B163 N309 2Upper1 P301 DR
J_A186 P301 2Lower0 0 DR
R538 VDD N310 100k
J_F156 VDD N310 P302 DR
R539 P302 n100 1k
R540 n100 VSS 4.8k
J_B164 N310 n99 0 DR
R541 VDD N311 100k
J_F157 VDD N311 P303 DR
R542 P303 n101 1k
R543 n101 VSS 4.8k
J_B165 N311 IOGroup P304 DR
J_A187 P304 n100 0 DR
R544 VDD N312 100k
J_F158 VDD N312 P305 DR
R545 P305 WR0 1k
R546 WR0 VSS 4.8k
J_B166 N312 n101 0 DR
R547 VDD N313 100k
J_F159 VDD N313 P306 DR
R548 P306 n103 1k
R549 n103 VSS 4.8k
J_B167 N313 2Upper1 P307 DR
J_A188 P307 2Lower1 0 DR
R550 VDD N314 100k
J_F160 VDD N314 P308 DR
R551 P308 n104 1k
R552 n104 VSS 4.8k
J_B168 N314 n103 0 DR
R553 VDD N315 100k
J_F161 VDD N315 P309 DR
R554 P309 n105 1k
R555 n105 VSS 4.8k
J_B169 N315 IOGroup P310 DR
J_A189 P310 n104 0 DR
R556 VDD N316 100k
J_F162 VDD N316 P311 DR
R557 P311 WR1 1k
R558 WR1 VSS 4.8k
J_B170 N316 n105 0 DR
R559 VDD N317 100k
J_F163 VDD N317 P312 DR
R560 P312 n107 1k
R561 n107 VSS 4.8k
J_B171 N317 2Upper1 P313 DR
J_A190 P313 2Lower2 0 DR
R562 VDD N318 100k
J_F164 VDD N318 P314 DR
R563 P314 n108 1k
R564 n108 VSS 4.8k
J_B172 N318 n107 0 DR
R565 VDD N319 100k
J_F165 VDD N319 P315 DR
R566 P315 n109 1k
R567 n109 VSS 4.8k
J_B173 N319 IOGroup P316 DR
J_A191 P316 n108 0 DR
R568 VDD N320 100k
J_F166 VDD N320 P317 DR
R569 P317 WR2 1k
R570 WR2 VSS 4.8k
J_B174 N320 n109 0 DR
R571 VDD N321 100k
J_F167 VDD N321 P318 DR
R572 P318 n111 1k
R573 n111 VSS 4.8k
J_B175 N321 2Upper1 P319 DR
J_A192 P319 2Lower3 0 DR
R574 VDD N322 100k
J_F168 VDD N322 P320 DR
R575 P320 n112 1k
R576 n112 VSS 4.8k
J_B176 N322 n111 0 DR
R577 VDD N323 100k
J_F169 VDD N323 P321 DR
R578 P321 n113 1k
R579 n113 VSS 4.8k
J_B177 N323 IOGroup P322 DR
J_A193 P322 n112 0 DR
R580 VDD N324 100k
J_F170 VDD N324 P323 DR
R581 P323 WR3 1k
R582 WR3 VSS 4.8k
J_B178 N324 n113 0 DR
R583 VDD N325 100k
J_F171 VDD N325 P324 DR
R584 P324 n115 1k
R585 n115 VSS 4.8k
J_B179 N325 2Upper2 P325 DR
J_A194 P325 2Lower0 0 DR
R586 VDD N326 100k
J_F172 VDD N326 P326 DR
R587 P326 n116 1k
R588 n116 VSS 4.8k
J_B180 N326 n115 0 DR
R589 VDD N327 100k
J_F173 VDD N327 P327 DR
R590 P327 n117 1k
R591 n117 VSS 4.8k
J_B181 N327 IOGroup P328 DR
J_A195 P328 n116 0 DR
R592 VDD N328 100k
J_F174 VDD N328 P329 DR
R593 P329 SBM 1k
R594 SBM VSS 4.8k
J_B182 N328 n117 0 DR
R595 VDD N329 100k
J_F175 VDD N329 P330 DR
R596 P330 n119 1k
R597 n119 VSS 4.8k
J_B183 N329 2Upper2 P331 DR
J_A196 P331 2Lower1 0 DR
R598 VDD N330 100k
J_F176 VDD N330 P332 DR
R599 P332 n120 1k
R600 n120 VSS 4.8k
J_B184 N330 n119 0 DR
R601 VDD N331 100k
J_F177 VDD N331 P333 DR
R602 P333 n121 1k
R603 n121 VSS 4.8k
J_B185 N331 IOGroup P334 DR
J_A197 P334 n120 0 DR
R604 VDD N332 100k
J_F178 VDD N332 P335 DR
R605 P335 RDM 1k
R606 RDM VSS 4.8k
J_B186 N332 n121 0 DR
R607 VDD N333 100k
J_F179 VDD N333 P336 DR
R608 P336 n123 1k
R609 n123 VSS 4.8k
J_B187 N333 2Upper2 P337 DR
J_A198 P337 2Lower2 0 DR
R610 VDD N334 100k
J_F180 VDD N334 P338 DR
R611 P338 n124 1k
R612 n124 VSS 4.8k
J_B188 N334 n123 0 DR
R613 VDD N335 100k
J_F181 VDD N335 P339 DR
R614 P339 n125 1k
R615 n125 VSS 4.8k
J_B189 N335 IOGroup P340 DR
J_A199 P340 n124 0 DR
R616 VDD N336 100k
J_F182 VDD N336 P341 DR
R617 P341 RDR 1k
R618 RDR VSS 4.8k
J_B190 N336 n125 0 DR
R619 VDD N337 100k
J_F183 VDD N337 P342 DR
R620 P342 n127 1k
R621 n127 VSS 4.8k
J_B191 N337 2Upper2 P343 DR
J_A200 P343 2Lower3 0 DR
R622 VDD N338 100k
J_F184 VDD N338 P344 DR
R623 P344 n128 1k
R624 n128 VSS 4.8k
J_B192 N338 n127 0 DR
R625 VDD N339 100k
J_F185 VDD N339 P345 DR
R626 P345 n129 1k
R627 n129 VSS 4.8k
J_B193 N339 IOGroup P346 DR
J_A201 P346 n128 0 DR
R628 VDD N340 100k
J_F186 VDD N340 P347 DR
R629 P347 ADM 1k
R630 ADM VSS 4.8k
J_B194 N340 n129 0 DR
R631 VDD N341 100k
J_F187 VDD N341 P348 DR
R632 P348 n131 1k
R633 n131 VSS 4.8k
J_B195 N341 2Upper3 P349 DR
J_A202 P349 2Lower0 0 DR
R634 VDD N342 100k
J_F188 VDD N342 P350 DR
R635 P350 n132 1k
R636 n132 VSS 4.8k
J_B196 N342 n131 0 DR
R637 VDD N343 100k
J_F189 VDD N343 P351 DR
R638 P351 n133 1k
R639 n133 VSS 4.8k
J_B197 N343 IOGroup P352 DR
J_A203 P352 n132 0 DR
R640 VDD N344 100k
J_F190 VDD N344 P353 DR
R641 P353 RD0 1k
R642 RD0 VSS 4.8k
J_B198 N344 n133 0 DR
R643 VDD N345 100k
J_F191 VDD N345 P354 DR
R644 P354 n135 1k
R645 n135 VSS 4.8k
J_B199 N345 2Upper3 P355 DR
J_A204 P355 2Lower1 0 DR
R646 VDD N346 100k
J_F192 VDD N346 P356 DR
R647 P356 n136 1k
R648 n136 VSS 4.8k
J_B200 N346 n135 0 DR
R649 VDD N347 100k
J_F193 VDD N347 P357 DR
R650 P357 n137 1k
R651 n137 VSS 4.8k
J_B201 N347 IOGroup P358 DR
J_A205 P358 n136 0 DR
R652 VDD N348 100k
J_F194 VDD N348 P359 DR
R653 P359 RD1 1k
R654 RD1 VSS 4.8k
J_B202 N348 n137 0 DR
R655 VDD N349 100k
J_F195 VDD N349 P360 DR
R656 P360 n139 1k
R657 n139 VSS 4.8k
J_B203 N349 2Upper3 P361 DR
J_A206 P361 2Lower2 0 DR
R658 VDD N350 100k
J_F196 VDD N350 P362 DR
R659 P362 n140 1k
R660 n140 VSS 4.8k
J_B204 N350 n139 0 DR
R661 VDD N351 100k
J_F197 VDD N351 P363 DR
R662 P363 n141 1k
R663 n141 VSS 4.8k
J_B205 N351 IOGroup P364 DR
J_A207 P364 n140 0 DR
R664 VDD N352 100k
J_F198 VDD N352 P365 DR
R665 P365 RD2 1k
R666 RD2 VSS 4.8k
J_B206 N352 n141 0 DR
R667 VDD N353 100k
J_F199 VDD N353 P366 DR
R668 P366 n143 1k
R669 n143 VSS 4.8k
J_B207 N353 2Upper3 P367 DR
J_A208 P367 2Lower3 0 DR
R670 VDD N354 100k
J_F200 VDD N354 P368 DR
R671 P368 n144 1k
R672 n144 VSS 4.8k
J_B208 N354 n143 0 DR
R673 VDD N355 100k
J_F201 VDD N355 P369 DR
R674 P369 n145 1k
R675 n145 VSS 4.8k
J_B209 N355 IOGroup P370 DR
J_A209 P370 n144 0 DR
R676 VDD N356 100k
J_F202 VDD N356 P371 DR
R677 P371 RD3 1k
R678 RD3 VSS 4.8k
J_B210 N356 n145 0 DR
R679 VDD N357 100k
J_F203 VDD N357 P372 DR
R680 P372 n147 1k
R681 n147 VSS 4.8k
J_B211 N357 WR1 0 DR
J_B212 N357 WR0 0 DR
R682 VDD N358 100k
J_F204 VDD N358 P373 DR
R683 P373 n148 1k
R684 n148 VSS 4.8k
J_B213 N358 n147 0 DR
R685 VDD N359 100k
J_F205 VDD N359 P374 DR
R686 P374 n149 1k
R687 n149 VSS 4.8k
J_B214 N359 WR2 0 DR
J_B215 N359 n148 0 DR
R688 VDD N360 100k
J_F206 VDD N360 P375 DR
R689 P375 n150 1k
R690 n150 VSS 4.8k
J_B216 N360 n149 0 DR
R691 VDD N361 100k
J_F207 VDD N361 P376 DR
R692 P376 n151 1k
R693 n151 VSS 4.8k
J_B217 N361 WR3 0 DR
J_B218 N361 n150 0 DR
R694 VDD N362 100k
J_F208 VDD N362 P377 DR
R695 P377 WR 1k
R696 WR VSS 4.8k
J_B219 N362 n151 0 DR
R697 VDD N363 100k
J_F209 VDD N363 P378 DR
R698 P378 n153 1k
R699 n153 VSS 4.8k
J_B220 N363 RD1 0 DR
J_B221 N363 RD0 0 DR
R700 VDD N364 100k
J_F210 VDD N364 P379 DR
R701 P379 n154 1k
R702 n154 VSS 4.8k
J_B222 N364 n153 0 DR
R703 VDD N365 100k
J_F211 VDD N365 P380 DR
R704 P380 n155 1k
R705 n155 VSS 4.8k
J_B223 N365 RD2 0 DR
J_B224 N365 n154 0 DR
R706 VDD N366 100k
J_F212 VDD N366 P381 DR
R707 P381 n156 1k
R708 n156 VSS 4.8k
J_B225 N366 n155 0 DR
R709 VDD N367 100k
J_F213 VDD N367 P382 DR
R710 P382 n157 1k
R711 n157 VSS 4.8k
J_B226 N367 RD3 0 DR
J_B227 N367 n156 0 DR
R712 VDD N368 100k
J_F214 VDD N368 P383 DR
R713 P383 RD 1k
R714 RD VSS 4.8k
J_B228 N368 n157 0 DR
R715 VDD N369 100k
J_F215 VDD N369 P384 DR
R716 P384 n159 1k
R717 n159 VSS 4.8k
J_B229 N369 Upper3 P385 DR
J_A210 P385 Lower3 0 DR
R718 VDD N370 100k
J_F216 VDD N370 P386 DR
R719 P386 ACCGroup 1k
R720 ACCGroup VSS 4.8k
J_B230 N370 n159 0 DR
R721 VDD N371 100k
J_F217 VDD N371 P387 DR
R722 P387 n161 1k
R723 n161 VSS 4.8k
J_B231 N371 2Upper0 P388 DR
J_A211 P388 2Lower0 0 DR
R724 VDD N372 100k
J_F218 VDD N372 P389 DR
R725 P389 n162 1k
R726 n162 VSS 4.8k
J_B232 N372 n161 0 DR
R727 VDD N373 100k
J_F219 VDD N373 P390 DR
R728 P390 n163 1k
R729 n163 VSS 4.8k
J_B233 N373 ACCGroup P391 DR
J_A212 P391 n162 0 DR
R730 VDD N374 100k
J_F220 VDD N374 P392 DR
R731 P392 CLB 1k
R732 CLB VSS 4.8k
J_B234 N374 n163 0 DR
R733 VDD N375 100k
J_F221 VDD N375 P393 DR
R734 P393 n165 1k
R735 n165 VSS 4.8k
J_B235 N375 2Upper0 P394 DR
J_A213 P394 2Lower1 0 DR
R736 VDD N376 100k
J_F222 VDD N376 P395 DR
R737 P395 n166 1k
R738 n166 VSS 4.8k
J_B236 N376 n165 0 DR
R739 VDD N377 100k
J_F223 VDD N377 P396 DR
R740 P396 n167 1k
R741 n167 VSS 4.8k
J_B237 N377 ACCGroup P397 DR
J_A214 P397 n166 0 DR
R742 VDD N378 100k
J_F224 VDD N378 P398 DR
R743 P398 CLC 1k
R744 CLC VSS 4.8k
J_B238 N378 n167 0 DR
R745 VDD N379 100k
J_F225 VDD N379 P399 DR
R746 P399 n169 1k
R747 n169 VSS 4.8k
J_B239 N379 2Upper0 P400 DR
J_A215 P400 2Lower2 0 DR
R748 VDD N380 100k
J_F226 VDD N380 P401 DR
R749 P401 n170 1k
R750 n170 VSS 4.8k
J_B240 N380 n169 0 DR
R751 VDD N381 100k
J_F227 VDD N381 P402 DR
R752 P402 n171 1k
R753 n171 VSS 4.8k
J_B241 N381 ACCGroup P403 DR
J_A216 P403 n170 0 DR
R754 VDD N382 100k
J_F228 VDD N382 P404 DR
R755 P404 IAC 1k
R756 IAC VSS 4.8k
J_B242 N382 n171 0 DR
R757 VDD N383 100k
J_F229 VDD N383 P405 DR
R758 P405 n173 1k
R759 n173 VSS 4.8k
J_B243 N383 2Upper0 P406 DR
J_A217 P406 2Lower3 0 DR
R760 VDD N384 100k
J_F230 VDD N384 P407 DR
R761 P407 n174 1k
R762 n174 VSS 4.8k
J_B244 N384 n173 0 DR
R763 VDD N385 100k
J_F231 VDD N385 P408 DR
R764 P408 n175 1k
R765 n175 VSS 4.8k
J_B245 N385 ACCGroup P409 DR
J_A218 P409 n174 0 DR
R766 VDD N386 100k
J_F232 VDD N386 P410 DR
R767 P410 CMC 1k
R768 CMC VSS 4.8k
J_B246 N386 n175 0 DR
R769 VDD N387 100k
J_F233 VDD N387 P411 DR
R770 P411 n177 1k
R771 n177 VSS 4.8k
J_B247 N387 2Upper1 P412 DR
J_A219 P412 2Lower0 0 DR
R772 VDD N388 100k
J_F234 VDD N388 P413 DR
R773 P413 n178 1k
R774 n178 VSS 4.8k
J_B248 N388 n177 0 DR
R775 VDD N389 100k
J_F235 VDD N389 P414 DR
R776 P414 n179 1k
R777 n179 VSS 4.8k
J_B249 N389 ACCGroup P415 DR
J_A220 P415 n178 0 DR
R778 VDD N390 100k
J_F236 VDD N390 P416 DR
R779 P416 CMA 1k
R780 CMA VSS 4.8k
J_B250 N390 n179 0 DR
R781 VDD N391 100k
J_F237 VDD N391 P417 DR
R782 P417 n181 1k
R783 n181 VSS 4.8k
J_B251 N391 2Upper1 P418 DR
J_A221 P418 2Lower1 0 DR
R784 VDD N392 100k
J_F238 VDD N392 P419 DR
R785 P419 n182 1k
R786 n182 VSS 4.8k
J_B252 N392 n181 0 DR
R787 VDD N393 100k
J_F239 VDD N393 P420 DR
R788 P420 n183 1k
R789 n183 VSS 4.8k
J_B253 N393 ACCGroup P421 DR
J_A222 P421 n182 0 DR
R790 VDD N394 100k
J_F240 VDD N394 P422 DR
R791 P422 RAL 1k
R792 RAL VSS 4.8k
J_B254 N394 n183 0 DR
R793 VDD N395 100k
J_F241 VDD N395 P423 DR
R794 P423 n185 1k
R795 n185 VSS 4.8k
J_B255 N395 2Upper1 P424 DR
J_A223 P424 2Lower2 0 DR
R796 VDD N396 100k
J_F242 VDD N396 P425 DR
R797 P425 n186 1k
R798 n186 VSS 4.8k
J_B256 N396 n185 0 DR
R799 VDD N397 100k
J_F243 VDD N397 P426 DR
R800 P426 n187 1k
R801 n187 VSS 4.8k
J_B257 N397 ACCGroup P427 DR
J_A224 P427 n186 0 DR
R802 VDD N398 100k
J_F244 VDD N398 P428 DR
R803 P428 RAR 1k
R804 RAR VSS 4.8k
J_B258 N398 n187 0 DR
R805 VDD N399 100k
J_F245 VDD N399 P429 DR
R806 P429 n189 1k
R807 n189 VSS 4.8k
J_B259 N399 2Upper1 P430 DR
J_A225 P430 2Lower3 0 DR
R808 VDD N400 100k
J_F246 VDD N400 P431 DR
R809 P431 n190 1k
R810 n190 VSS 4.8k
J_B260 N400 n189 0 DR
R811 VDD N401 100k
J_F247 VDD N401 P432 DR
R812 P432 n191 1k
R813 n191 VSS 4.8k
J_B261 N401 ACCGroup P433 DR
J_A226 P433 n190 0 DR
R814 VDD N402 100k
J_F248 VDD N402 P434 DR
R815 P434 TCC 1k
R816 TCC VSS 4.8k
J_B262 N402 n191 0 DR
R817 VDD N403 100k
J_F249 VDD N403 P435 DR
R818 P435 n193 1k
R819 n193 VSS 4.8k
J_B263 N403 2Upper2 P436 DR
J_A227 P436 2Lower0 0 DR
R820 VDD N404 100k
J_F250 VDD N404 P437 DR
R821 P437 n194 1k
R822 n194 VSS 4.8k
J_B264 N404 n193 0 DR
R823 VDD N405 100k
J_F251 VDD N405 P438 DR
R824 P438 n195 1k
R825 n195 VSS 4.8k
J_B265 N405 ACCGroup P439 DR
J_A228 P439 n194 0 DR
R826 VDD N406 100k
J_F252 VDD N406 P440 DR
R827 P440 DAC 1k
R828 DAC VSS 4.8k
J_B266 N406 n195 0 DR
R829 VDD N407 100k
J_F253 VDD N407 P441 DR
R830 P441 n197 1k
R831 n197 VSS 4.8k
J_B267 N407 2Upper2 P442 DR
J_A229 P442 2Lower1 0 DR
R832 VDD N408 100k
J_F254 VDD N408 P443 DR
R833 P443 n198 1k
R834 n198 VSS 4.8k
J_B268 N408 n197 0 DR
R835 VDD N409 100k
J_F255 VDD N409 P444 DR
R836 P444 n199 1k
R837 n199 VSS 4.8k
J_B269 N409 ACCGroup P445 DR
J_A230 P445 n198 0 DR
R838 VDD N410 100k
J_F256 VDD N410 P446 DR
R839 P446 TCS 1k
R840 TCS VSS 4.8k
J_B270 N410 n199 0 DR
R841 VDD N411 100k
J_F257 VDD N411 P447 DR
R842 P447 n201 1k
R843 n201 VSS 4.8k
J_B271 N411 2Upper2 P448 DR
J_A231 P448 2Lower2 0 DR
R844 VDD N412 100k
J_F258 VDD N412 P449 DR
R845 P449 n202 1k
R846 n202 VSS 4.8k
J_B272 N412 n201 0 DR
R847 VDD N413 100k
J_F259 VDD N413 P450 DR
R848 P450 n203 1k
R849 n203 VSS 4.8k
J_B273 N413 ACCGroup P451 DR
J_A232 P451 n202 0 DR
R850 VDD N414 100k
J_F260 VDD N414 P452 DR
R851 P452 STC 1k
R852 STC VSS 4.8k
J_B274 N414 n203 0 DR
R853 VDD N415 100k
J_F261 VDD N415 P453 DR
R854 P453 n205 1k
R855 n205 VSS 4.8k
J_B275 N415 2Upper2 P454 DR
J_A233 P454 2Lower3 0 DR
R856 VDD N416 100k
J_F262 VDD N416 P455 DR
R857 P455 n206 1k
R858 n206 VSS 4.8k
J_B276 N416 n205 0 DR
R859 VDD N417 100k
J_F263 VDD N417 P456 DR
R860 P456 n207 1k
R861 n207 VSS 4.8k
J_B277 N417 ACCGroup P457 DR
J_A234 P457 n206 0 DR
R862 VDD N418 100k
J_F264 VDD N418 P458 DR
R863 P458 DAA 1k
R864 DAA VSS 4.8k
J_B278 N418 n207 0 DR
R865 VDD N419 100k
J_F265 VDD N419 P459 DR
R866 P459 n209 1k
R867 n209 VSS 4.8k
J_B279 N419 2Upper3 P460 DR
J_A235 P460 2Lower0 0 DR
R868 VDD N420 100k
J_F266 VDD N420 P461 DR
R869 P461 n210 1k
R870 n210 VSS 4.8k
J_B280 N420 n209 0 DR
R871 VDD N421 100k
J_F267 VDD N421 P462 DR
R872 P462 n211 1k
R873 n211 VSS 4.8k
J_B281 N421 ACCGroup P463 DR
J_A236 P463 n210 0 DR
R874 VDD N422 100k
J_F268 VDD N422 P464 DR
R875 P464 KBP 1k
R876 KBP VSS 4.8k
J_B282 N422 n211 0 DR
R877 VDD N423 100k
J_F269 VDD N423 P465 DR
R878 P465 n213 1k
R879 n213 VSS 4.8k
J_B283 N423 2Upper3 P466 DR
J_A237 P466 2Lower1 0 DR
R880 VDD N424 100k
J_F270 VDD N424 P467 DR
R881 P467 n214 1k
R882 n214 VSS 4.8k
J_B284 N424 n213 0 DR
R883 VDD N425 100k
J_F271 VDD N425 P468 DR
R884 P468 n215 1k
R885 n215 VSS 4.8k
J_B285 N425 ACCGroup P469 DR
J_A238 P469 n214 0 DR
R886 VDD N426 100k
J_F272 VDD N426 P470 DR
R887 P470 DCL 1k
R888 DCL VSS 4.8k
J_B286 N426 n215 0 DR
R889 VDD N427 100k
J_F273 VDD N427 P471 DR
R890 P471 n217 1k
R891 n217 VSS 4.8k
J_B287 N427 FIM 0 DR
J_B288 N427 JCN 0 DR
R892 VDD N428 100k
J_F274 VDD N428 P472 DR
R893 P472 n218 1k
R894 n218 VSS 4.8k
J_B289 N428 n217 0 DR
R895 VDD N429 100k
J_F275 VDD N429 P473 DR
R896 P473 n219 1k
R897 n219 VSS 4.8k
J_B290 N429 JUN 0 DR
J_B291 N429 n218 0 DR
R898 VDD N430 100k
J_F276 VDD N430 P474 DR
R899 P474 n220 1k
R900 n220 VSS 4.8k
J_B292 N430 n219 0 DR
R901 VDD N431 100k
J_F277 VDD N431 P475 DR
R902 P475 n221 1k
R903 n221 VSS 4.8k
J_B293 N431 JMS 0 DR
J_B294 N431 n220 0 DR
R904 VDD N432 100k
J_F278 VDD N432 P476 DR
R905 P476 n222 1k
R906 n222 VSS 4.8k
J_B295 N432 n221 0 DR
R907 VDD N433 100k
J_F279 VDD N433 P477 DR
R908 P477 n223 1k
R909 n223 VSS 4.8k
J_B296 N433 ISZ 0 DR
J_B297 N433 n222 0 DR
R910 VDD N434 100k
J_F280 VDD N434 P478 DR
R911 P478 2Word 1k
R912 2Word VSS 4.8k
J_B298 N434 n223 0 DR
R913 VDD N435 100k
J_F281 VDD N435 P479 DR
R914 P479 n225 1k
R915 n225 VSS 4.8k
J_B299 N435 JUN 0 DR
J_B300 N435 JCN 0 DR
R916 VDD N436 100k
J_F282 VDD N436 P480 DR
R917 P480 n226 1k
R918 n226 VSS 4.8k
J_B301 N436 n225 0 DR
R919 VDD N437 100k
J_F283 VDD N437 P481 DR
R920 P481 n227 1k
R921 n227 VSS 4.8k
J_B302 N437 JMS 0 DR
J_B303 N437 n226 0 DR
R922 VDD N438 100k
J_F284 VDD N438 P482 DR
R923 P482 n228 1k
R924 n228 VSS 4.8k
J_B304 N438 n227 0 DR
R925 VDD N439 100k
J_F285 VDD N439 P483 DR
R926 P483 n229 1k
R927 n229 VSS 4.8k
J_B305 N439 ISZ 0 DR
J_B306 N439 n228 0 DR
R928 VDD N440 100k
J_F286 VDD N440 P484 DR
R929 P484 n230 1k
R930 n230 VSS 4.8k
J_B307 N440 n229 0 DR
R931 VDD N441 100k
J_F287 VDD N441 P485 DR
R932 P485 n231 1k
R933 n231 VSS 4.8k
J_B308 N441 JIN 0 DR
J_B309 N441 n230 0 DR
R934 VDD N442 100k
J_F288 VDD N442 P486 DR
R935 P486 Jump 1k
R936 Jump VSS 4.8k
J_B310 N442 n231 0 DR
.model NJF NJF
.model PJF PJF
.lib standard.jft
.backanno
.end